# Altium schematic sheet Sheet2.SchDoc
size A
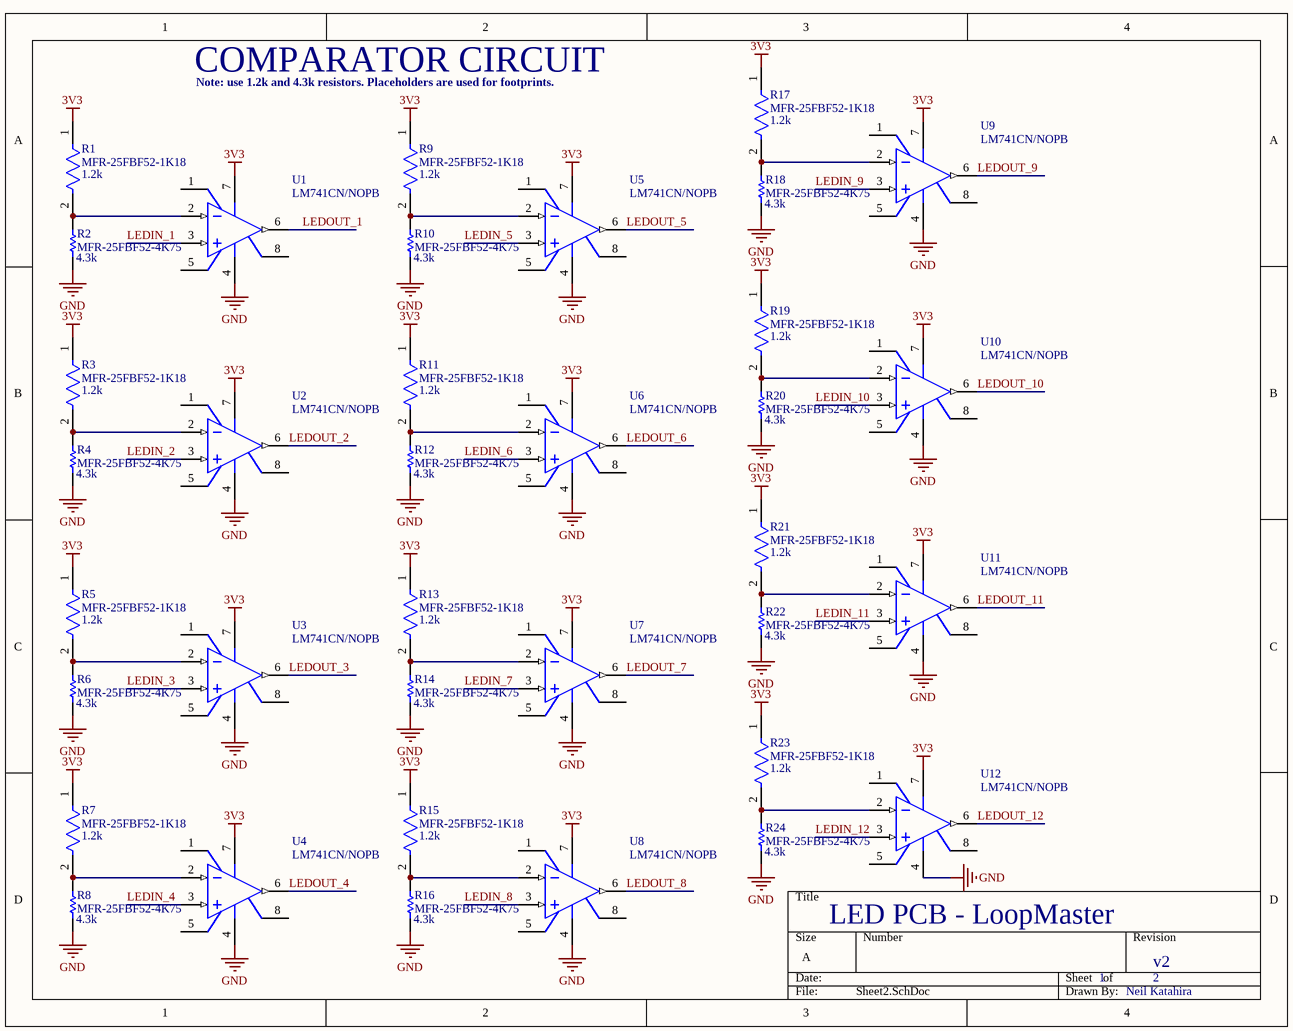
[diagram p0: Sheet2.SchDoc]

## Parts
R1  MFR-25FBF52-1K18  [FP-MFR-25-MFG]
R2  MFR-25FBF52-4K75  [RESA60-630X240]
R3  MFR-25FBF52-1K18  [FP-MFR-25-MFG]
R4  MFR-25FBF52-4K75  [RESA60-630X240]
R5  MFR-25FBF52-1K18  [FP-MFR-25-MFG]
R6  MFR-25FBF52-4K75  [RESA60-630X240]
R7  MFR-25FBF52-1K18  [FP-MFR-25-MFG]
R8  MFR-25FBF52-4K75  [RESA60-630X240]
R9  MFR-25FBF52-1K18  [FP-MFR-25-MFG]
R10  MFR-25FBF52-4K75  [RESA60-630X240]
R11  MFR-25FBF52-1K18  [FP-MFR-25-MFG]
R12  MFR-25FBF52-4K75  [RESA60-630X240]
R13  MFR-25FBF52-1K18  [FP-MFR-25-MFG]
R14  MFR-25FBF52-4K75  [RESA60-630X240]
R15  MFR-25FBF52-1K18  [FP-MFR-25-MFG]
R16  MFR-25FBF52-4K75  [RESA60-630X240]
R17  MFR-25FBF52-1K18  [FP-MFR-25-MFG]
R18  MFR-25FBF52-4K75  [RESA60-630X240]
R19  MFR-25FBF52-1K18  [FP-MFR-25-MFG]
R20  MFR-25FBF52-4K75  [RESA60-630X240]
R21  MFR-25FBF52-1K18  [FP-MFR-25-MFG]
R22  MFR-25FBF52-4K75  [RESA60-630X240]
R23  MFR-25FBF52-1K18  [FP-MFR-25-MFG]
R24  MFR-25FBF52-4K75  [RESA60-630X240]
U1  LM741CN/NOPB  [P0008A]
U2  LM741CN/NOPB  [P0008A]
U3  LM741CN/NOPB  [P0008A]
U4  LM741CN/NOPB  [P0008A]
U5  LM741CN/NOPB  [P0008A]
U6  LM741CN/NOPB  [P0008A]
U7  LM741CN/NOPB  [P0008A]
U8  LM741CN/NOPB  [P0008A]
U9  LM741CN/NOPB  [P0008A]
U10  LM741CN/NOPB  [P0008A]
U11  LM741CN/NOPB  [P0008A]
U12  LM741CN/NOPB  [P0008A]

## Nets
3V3: R1.1 R3.1 R5.1 R7.1 R9.1 R11.1 R13.1 R15.1 R17.1 R19.1 R21.1 R23.1 U1.7(V+) U2.7(V+) U3.7(V+) U4.7(V+) U5.7(V+) U6.7(V+) U7.7(V+) U8.7(V+) U9.7(V+) U10.7(V+) U11.7(V+) U12.7(V+)
GND: R2.1 R4.1 R6.1 R8.1 R10.1 R12.1 R14.1 R16.1 R18.1 R20.1 R22.1 R24.1 U1.4(V-) U2.4(V-) U3.4(V-) U4.4(V-) U5.4(V-) U6.4(V-) U7.4(V-) U8.4(V-) U9.4(V-) U10.4(V-) U11.4(V-) U12.4(V-)
LEDIN_1: U1.3(IN+)
LEDIN_2: U2.3(IN+)
LEDIN_3: U3.3(IN+)
LEDIN_4: U4.3(IN+)
LEDIN_5: U5.3(IN+)
LEDIN_6: U6.3(IN+)
LEDIN_7: U7.3(IN+)
LEDIN_8: U8.3(IN+)
LEDIN_9: U9.3(IN+)
LEDIN_10: U10.3(IN+)
LEDIN_11: U11.3(IN+)
LEDIN_12: U12.3(IN+)
LEDOUT_1: U1.6(OUT)
LEDOUT_2: U2.6(OUT)
LEDOUT_3: U3.6(OUT)
LEDOUT_4: U4.6(OUT)
LEDOUT_5: U5.6(OUT)
LEDOUT_6: U6.6(OUT)
LEDOUT_7: U7.6(OUT)
LEDOUT_8: U8.6(OUT)
LEDOUT_9: U9.6(OUT)
LEDOUT_10: U10.6(OUT)
LEDOUT_11: U11.6(OUT)
LEDOUT_12: U12.6(OUT)
NetR1_2: R1.2 R2.2 U1.2(IN-)
NetR3_2: R3.2 R4.2 U2.2(IN-)
NetR5_2: R5.2 R6.2 U3.2(IN-)
NetR7_2: R7.2 R8.2 U4.2(IN-)
NetR9_2: R9.2 R10.2 U5.2(IN-)
NetR11_2: R11.2 R12.2 U6.2(IN-)
NetR13_2: R13.2 R14.2 U7.2(IN-)
NetR15_2: R15.2 R16.2 U8.2(IN-)
NetR17_2: R17.2 R18.2 U9.2(IN-)
NetR19_2: R19.2 R20.2 U10.2(IN-)
NetR21_2: R21.2 R22.2 U11.2(IN-)
NetR23_2: R23.2 R24.2 U12.2(IN-)

Not connected (* = marked no-connect by the designer): U1 1(OFS_NULL) 5(OFS_NULL) 8(NC); U2 1(OFS_NULL) 5(OFS_NULL) 8(NC); U3 1(OFS_NULL) 5(OFS_NULL) 8(NC); U4 1(OFS_NULL) 5(OFS_NULL) 8(NC); U5 1(OFS_NULL) 5(OFS_NULL) 8(NC); U6 1(OFS_NULL) 5(OFS_NULL) 8(NC); U7 1(OFS_NULL) 5(OFS_NULL) 8(NC); U8 1(OFS_NULL) 5(OFS_NULL) 8(NC); U9 1(OFS_NULL) 5(OFS_NULL) 8(NC); U10 1(OFS_NULL) 5(OFS_NULL) 8(NC); U11 1(OFS_NULL) 5(OFS_NULL) 8(NC); U12 1(OFS_NULL) 5(OFS_NULL) 8(NC)

## Notes on the sheet
- COMPARATOR CIRCUIT
- Note: use 1.2k and 4.3k resistors. Placeholders are used for footprints.
- (near R17) 1.2k
- (near R1) 1.2k
- (near R9) 1.2k
- (near R18) 4.3k
- (near R2) 4.3k
- (near R10) 4.3k
- (near R19) 1.2k
- (near R3) 1.2k
- (near R11) 1.2k
- (near R20) 4.3k
- (near R4) 4.3k
- (near R12) 4.3k
- (near R21) 1.2k
- (near R5) 1.2k
- (near R13) 1.2k
- (near R22) 4.3k
- (near R6) 4.3k
- (near R14) 4.3k
- (near R23) 1.2k
- (near R7) 1.2k
- (near R15) 1.2k
- (near R24) 4.3k
- (near R8) 4.3k
- (near R16) 4.3k
- (near U12) LED PCB - LoopMaster
- 1
- 2
- v2
- Neil Katahira

## Library data of the parts
R1 R3 R5 R7 R9 R11 R13 R15 R17 R19 R21 R23 = CMP-03413-000001-1: RES 1.18K OHM 1/4W 1% AXIAL; Manufacturer: Yageo; Value: 1.18kΩ; Description: 1.18 kOhms ±1% 0.25W, 1/4W Through Hole Resistor Axial  Metal Film; Temperature Coefficient: 100ppm/°C; Power Rating: 0.25W; Voltage Rating: 250V; Temperature: -55°C to +155°C; Automotive: No; Temperature Range High: +155°C; Mouser Description: Metal Film Resistors 1.18K OHM 1/4W 1%; Digikey Description: RES 1.18K OHM 1/4W 1% AXIAL; Lead Free: Yes; Tolerance: 1%; ComponentLink2Description: Datasheet; ComponentLink2URL: https://www.yageo.com/upload/media/product/products/datasheet/lr/Yageo_LR_MFR_1.pdf; Temperature Range Low: -55°C; Package: MFR-25; Ipc Land Pattern Name: RESAD1000W75L680D260; Composition: Metal Film; Category: Res; Octopart: https://octopart.com/mfr-25fbf52-1k18-yageo-56251681; Series: MFR; Device Class L2: Resistors; Height: 2.6mm; Resistance: 1.18kΩ; Device Class L3: Through-Hole Resistors; Manufacturer Part Number: MFR-25FBF52-1K18; RoHS: TRUE; Device Class L1: Passive Components
R2 R4 R6 R8 R10 R12 R14 R16 R18 R20 R22 R24 = CMP-1659-00066-1: Axial Resistor, 4.75 KOhm, +/- 1%, 0.25 W, -55 to 155 degC, 2-Pin THD, RoHS, Bulk; Case\Package: 1210; Voltage Rating (DC): 25 V; Type (Capacitors): X7R; Capacitance: 22 uF; Tolerance: 10%; PackageReference: MFR-25; DatasheetVersion: Apr-13; PackageDescription: 2-Pin Axial Lead, Dia 2.4 mm, Body Length 6.3 mm; ComponentLink1URL: http://www.yageo.com/; Radiation Hardening: No; Mount: Surface Mount; Height: 2.5 mm; Pins: 2; Package Quantity: 1000; REACH SVHC: No SVHC; Case Code (Imperial): 1210; Packaging: Tape and Reel; Max Operating Temperature: 125 degC; Case Code (Metric): 3225; ComponentLink1Description: Manufacturer URL; Min Operating Temperature: -55 degC; ComponentLink2Description: Datasheet; Voltage Rating: 25 V; Length: 3.2 mm; ComponentLink2URL: http://www.yageo.com/documents/recent/Yageo%20LR_MFR_2013.pdf; RoHSCompliant: true; Width: 2.5 mm
U1-U12 = CMP-0055-00162-3: Operational Amplifier, 8-pin MDIP, Pb-Free; Manufacturer: Texas Instruments; PackageTopMarking: NSUZXYTTE#*LM*741CN; PowerWise: N; CompType: Amplifiers; ComponentLink1Description: Datasheet URL; ComponentLink1URL: http://www.ti.com/general/docs/lit/getliterature.tsp?genericPartNumber=LM741&fileType=pdf; PackageDescription: MDIP, .365 x .250 x .130in, 8 Lead, .100in Pitch; RoHS: Y; PinCount: 8; Code_JEDEC: MS-001-BA; Package Reference: P0008A